# EAGLE schematic cny70 (EAGLE 6.5.0)
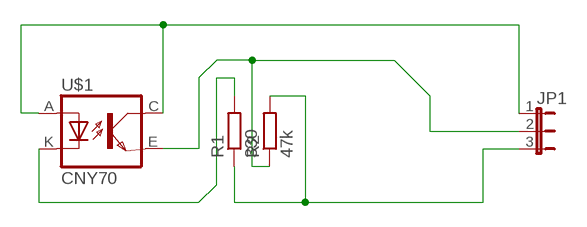
[diagram p0: schematic, sheet 1]

## Parts
JP1  JP2E  [JP2]
R1  330  R-EU_0207/10  [0207/10]
R2  47k  R-EU_0207/10  [0207/10]
U$1  CNY70  [4]

## Nets
N$1: JP1.1 U$1.A U$1.C(COL)
N$2: R1.2 U$1.K(C)
N$3: JP1.3 R1.1 R2.2
N$4: JP1.2 R2.1 U$1.E(EMI)

## Library data of the parts
JP1 = jumper:JP2E: JUMPER
R1 R2 = resistor:R-EU_: RESISTOR, European symbol
U$1 = cny70:CNY70